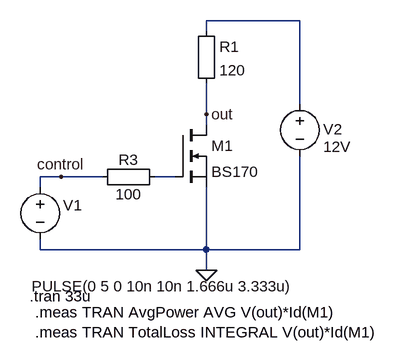
[diagram p0: schematic MOSFET_Switch.asc]
MOSFET_Switch.asc, the LTspice schematic file:
Version 4.1
SHEET 1 1292 680
WIRE -576 -256 -720 -256
WIRE -720 -240 -720 -256
WIRE -576 -128 -576 -256
WIRE -720 -112 -720 -160
WIRE -720 -96 -720 -112
WIRE -944 -16 -976 -16
WIRE -880 -16 -944 -16
WIRE -768 -16 -800 -16
WIRE -976 0 -976 -16
WIRE -976 96 -976 80
WIRE -720 96 -720 0
WIRE -720 96 -976 96
WIRE -576 96 -576 -48
WIRE -576 96 -720 96
WIRE -720 128 -720 96
FLAG -720 128 0
FLAG -944 -16 control
FLAG -720 -112 out
SYMBOL voltage -576 -144 R0
WINDOW 123 0 0 Left 2
WINDOW 39 37 60 Left 2
WINDOW 0 36 55 Left 2
WINDOW 3 36 82 Left 2
SYMATTR InstName V2
SYMATTR Value 12V
SYMBOL voltage -976 -16 R0
WINDOW 123 0 0 Left 2
WINDOW 3 -13 168 Left 2
WINDOW 0 35 44 Left 2
WINDOW 39 -81 178 Left 2
SYMATTR Value PULSE(0 5 0 10n 10n 1.666u 3.333u)
SYMATTR InstName V1
SYMBOL nmos -768 -96 R0
SYMATTR InstName M1
SYMATTR Value BS170
SYMBOL Misc\\EuropeanResistor -736 -256 R0
SYMATTR InstName R1
SYMATTR Value 120
SYMBOL Misc\\EuropeanResistor -784 -32 R90
WINDOW 0 5 56 VBottom 2
WINDOW 3 27 56 VTop 2
SYMATTR InstName R3
SYMATTR Value 100
TEXT -992 168 Left 2 !.tran 33u
TEXT -984 192 Left 2 !.meas TRAN AvgPower AVG V(out)*Id(M1)\n.meas TRAN TotalLoss INTEGRAL V(out)*Id(M1)

The netlist it stands for:
* MOSFET_Switch.asc
V2 N001 0 12V
V1 control 0 PULSE(0 5 0 10n 10n 1.666u 3.333u)
M1 out N002 0 0 BS170
R1 N001 out 120
R3 N002 control 100
.model NMOS NMOS
.model PMOS PMOS
.lib standard.mos
.tran 33u
.meas TRAN AvgPower AVG V(out)*Id(M1)
.meas TRAN TotalLoss INTEGRAL V(out)*Id(M1)
.backanno
.end